# Altium project GateWay.PrjPCB
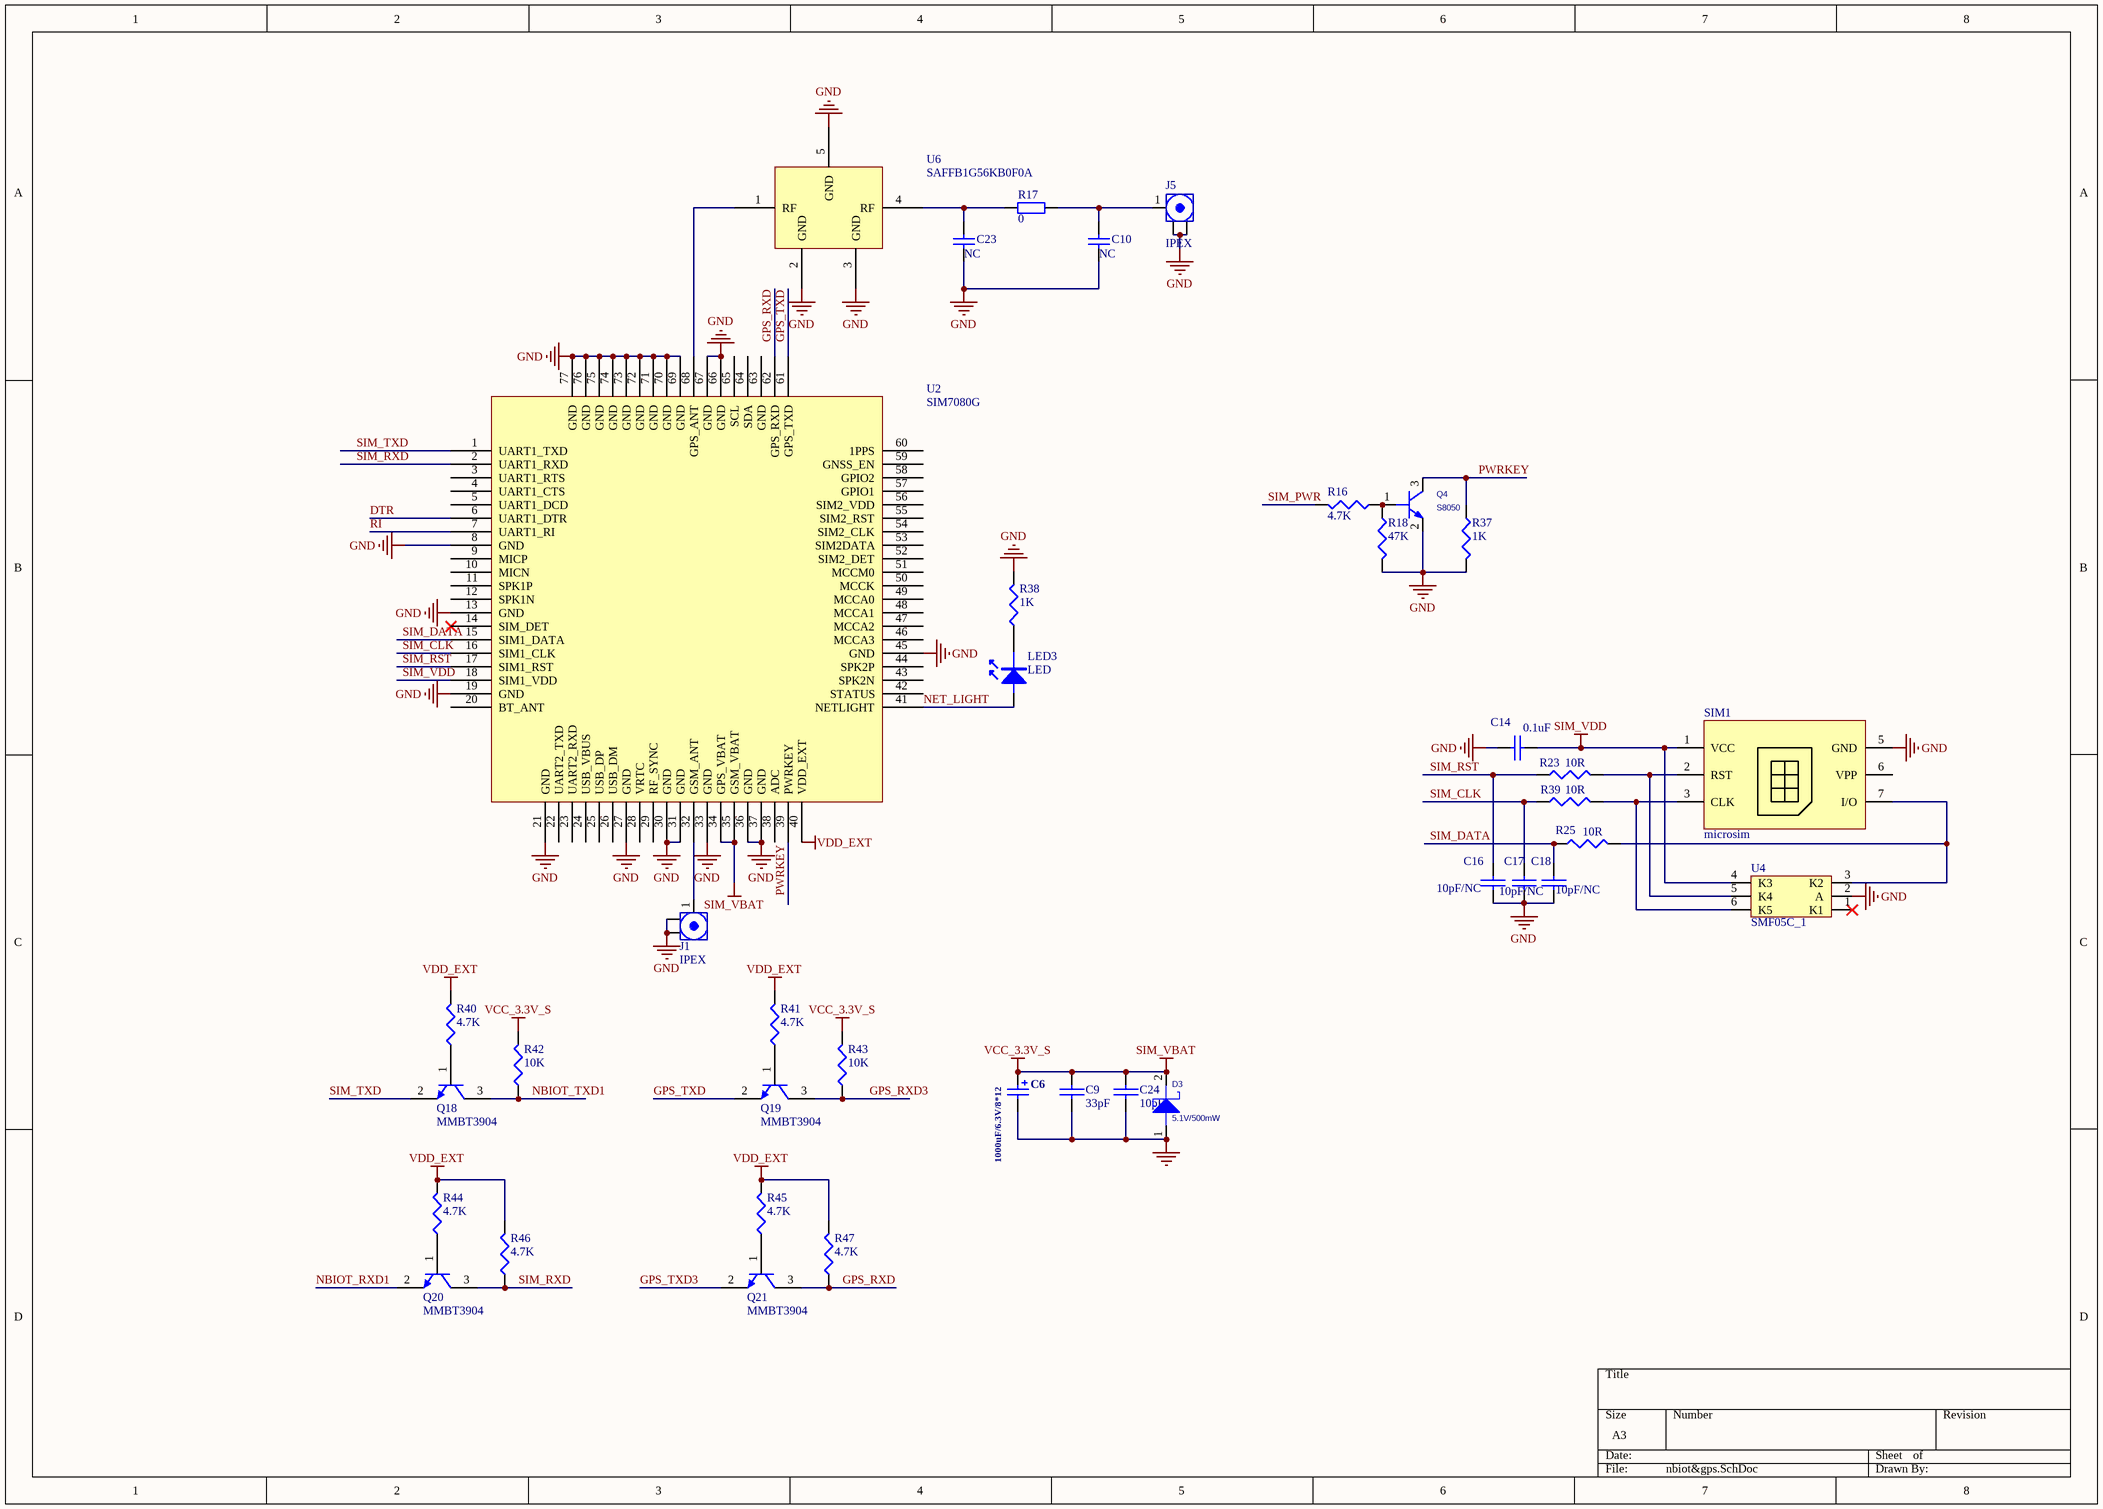
[diagram p0: nbiot&gps.SchDoc]
2 sheets, 85 parts. Net scope: global (net labels, ports and power ports of the same name join across sheets).
Board file: GateWay.PcbDoc
Sheets:
  nbiot&gps.SchDoc
  CONNECTOR.SchDoc

## Sheet nbiot&gps.SchDoc
size A3

### Parts
C6  1000uF/6.3V/8*12  [8*12]
C9  33pF  [0603C]
C10  NC  [0603C]
C14  0.1uF  [0603C]
C16  10pF/NC  [0603C]
C17  10pF/NC  [0603C]
C18  10pF/NC  [0603C]
C23  NC  [0603C]
C24  10pF  [0603C]
D3  value 5.1V/500mW  [LL-34(D1206)]  (hidden comment: DIODE_SCHOTTKY_0)
J1  IPEX  [RF-UFL]
J5  IPEX  [RF-UFL]
LED3  LED  [0603LED]
Q4  S8050  [SOT23]
Q18  MMBT3904  [SOT23-3]
Q19  MMBT3904  [SOT23-3]
Q20  MMBT3904  [SOT23-3]
Q21  MMBT3904  [SOT23-3]
R16  4.7K  [0603R]
R17  0  [0603R]
R18  47K  [0603R]
R23  10R  [0603R]
R25  10R  [0603R]
R37  1K  [0603R]
R38  1K  [0603R]
R39  10R  [0603R]
R40  4.7K  [0603R]
R41  4.7K  [0603R]
R42  10K  [0603R]
R43  10K  [0603R]
R44  4.7K  [0603R]
R45  4.7K  [0603R]
R46  4.7K  [0603R]
R47  4.7K  [0603R]
SIM1  microsim  [Nano SIM]
U2  SIM7080G  [SIM868]
U4  SMF05C_1  [SC70-6L]
U6  SAFFB1G56KB0F0A  [SAFFB1G56KB0F0A]

### Nets
GND: C6.2 C9.1 C10.2 C14.1 C16.1 C17.1 C18.1 C23.2 C24.1 D3.1 J1.2(Y) J5.2(Y) Q4.2(E) R18.2 R37.2 R38.2 SIM1.5(GND) U2.8(GND) U2.13(GND) U2.19(GND) U2.21(GND) U2.27(GND) U2.30(GND) U2.31(GND) U2.33(GND) U2.36(GND) U2.37(GND) U2.45(GND) U2.66(GND) U2.67(GND) U2.69(GND) U2.70(GND) U2.71(GND) U2.72(GND) U2.73(GND) U2.74(GND) U2.75(GND) U2.76(GND) U2.77(GND) U4.2(A) U6.2(GND) U6.3(GND) U6.5(GND)
SIM_VBAT: C6.1 C9.2 C24.2 D3.2 R42.2 R43.2 U2.34(GPS_VBAT) U2.35(GSM_VBAT)  [also labelled VCC_3.3V_S]
SIM_VDD: C14.2 SIM1.1(VCC) U2.18(SIM1_VDD) U4.4(K3)
VDD_EXT: R40.2 R41.2 R44.2 R45.2 R46.2 R47.2 U2.40(VDD_EXT)
DTR: U2.6(UART1_DTR)
GPS_RXD: Q21.3(C) R47.1 U2.62(GPS_RXD)
GPS_RXD3: Q19.3(C) R43.1
GPS_TXD: Q19.2(E) U2.61(GPS_TXD)
GPS_TXD3: Q21.2(E)
NBIOT_RXD1: Q20.2(E)
NBIOT_TXD1: Q18.3(C) R42.1
NET_LIGHT: LED3.1 U2.41(NETLIGHT)
PWRKEY: Q4.3(C) R37.1 U2.39(PWRKEY)
RI: U2.7(UART1_RI)
SIM_CLK: C17.2 R39.1 U2.16(SIM1_CLK)
SIM_DATA: C18.2 R25.1 U2.15(SIM1_DATA)
SIM_PWR: R16.2
SIM_RST: C16.2 R23.1 U2.17(SIM1_RST)
SIM_RXD: Q20.3(C) R46.1 U2.2(UART1_RXD)
SIM_TXD: Q18.2(E) U2.1(UART1_TXD)
NetC10_1: C10.1 J5.1(X) R17.2
NetC23_1: C23.1 R17.1 U6.4(RF)
NetJ1_1: J1.1(X) U2.32(GSM_ANT)
NetLED3_2: LED3.2 R38.1
NetQ4_1: Q4.1(B) R16.1 R18.1
NetQ18_1: Q18.1(B) R40.1
NetQ19_1: Q19.1(B) R41.1
NetQ20_1: Q20.1(B) R44.1
NetQ21_1: Q21.1(B) R45.1
NetR23_2: R23.2 SIM1.2(RST) U4.5(K4)
NetR25_2: R25.2 SIM1.7(I/O) U4.3(K2)
NetR39_2: R39.2 SIM1.3(CLK) U4.6(K5)
NetU2_68: U2.68(GPS_ANT) U6.1(RF)

Not connected (* = marked no-connect by the designer): SIM1 6(VPP); U2 3(UART1_RTS) 4(UART1_CTS) 5(UART1_DCD) 9(MICP) 10(MICN) 11(SPK1P) 12(SPK1N) 14(SIM_DET)* 20(BT_ANT) 22(UART2_TXD) 23(UART2_RXD) 24(USB_VBUS) 25(USB_DP) 26(USB_DM) 28(VRTC) 29(RF_SYNC) 38(ADC) 42(STATUS) 43(SPK2N) 44(SPK2P) 46(MCCA3) 47(MCCA2) 48(MCCA1) 49(MCCA0) 50(MCCK) 51(MCCM0) 52(SIM2_DET) 53(SIM2DATA) 54(SIM2_CLK) 55(SIM2_RST) 56(SIM2_VDD) 57(GPIO1) 58(GPIO2) 59(GNSS_EN) 60(1PPS) 63(GND) 64(SDA) 65(SCL); U4 1(K1)*

### Library data of the parts
C6 = Cap Pol3: Polarized Capacitor (Surface Mount); PackageReference: C10*10.2
C9 C14 C16-C18 C24 = CAP: Capacitor
C10 C23 = Cap: Capacitor; Value: 0.1uF/10V; Published: 8-Jun-2000; LatestRevisionDate: 17-Jul-2002; LatestRevisionNote: Re-released for DXP Platform.; PackageReference: RAD-0.3; Publisher: Altium Limited
D3 = DIODE_SCHOTTKY_0: PCB DECAL: DO_214AC; Source_Path: E:\AIH\WORK\A\LIBRARY1.OLB
J1 J5 = ANT
Q4 = 2N1069_1: PspiceTemplate: Q^@REFDES %C %B %E
Q18-Q21 = NPN
R16 R18 R23 R25 R37-R47 = RES1: P: 1/8W
R17 = Res2: Resistor; Published: 8-Jun-2000; LatestRevisionDate: 17-Jul-2002; LatestRevisionNote: Re-released for DXP Platform.; PackageReference: AXIAL-0.4; Publisher: Altium Limited; Value: 0
U2 = SIM868E/SIM868
U4 = SMF05C_1: TVS
U6 = SAFFB1G56KBOFA

## Sheet CONNECTOR.SchDoc
size A3
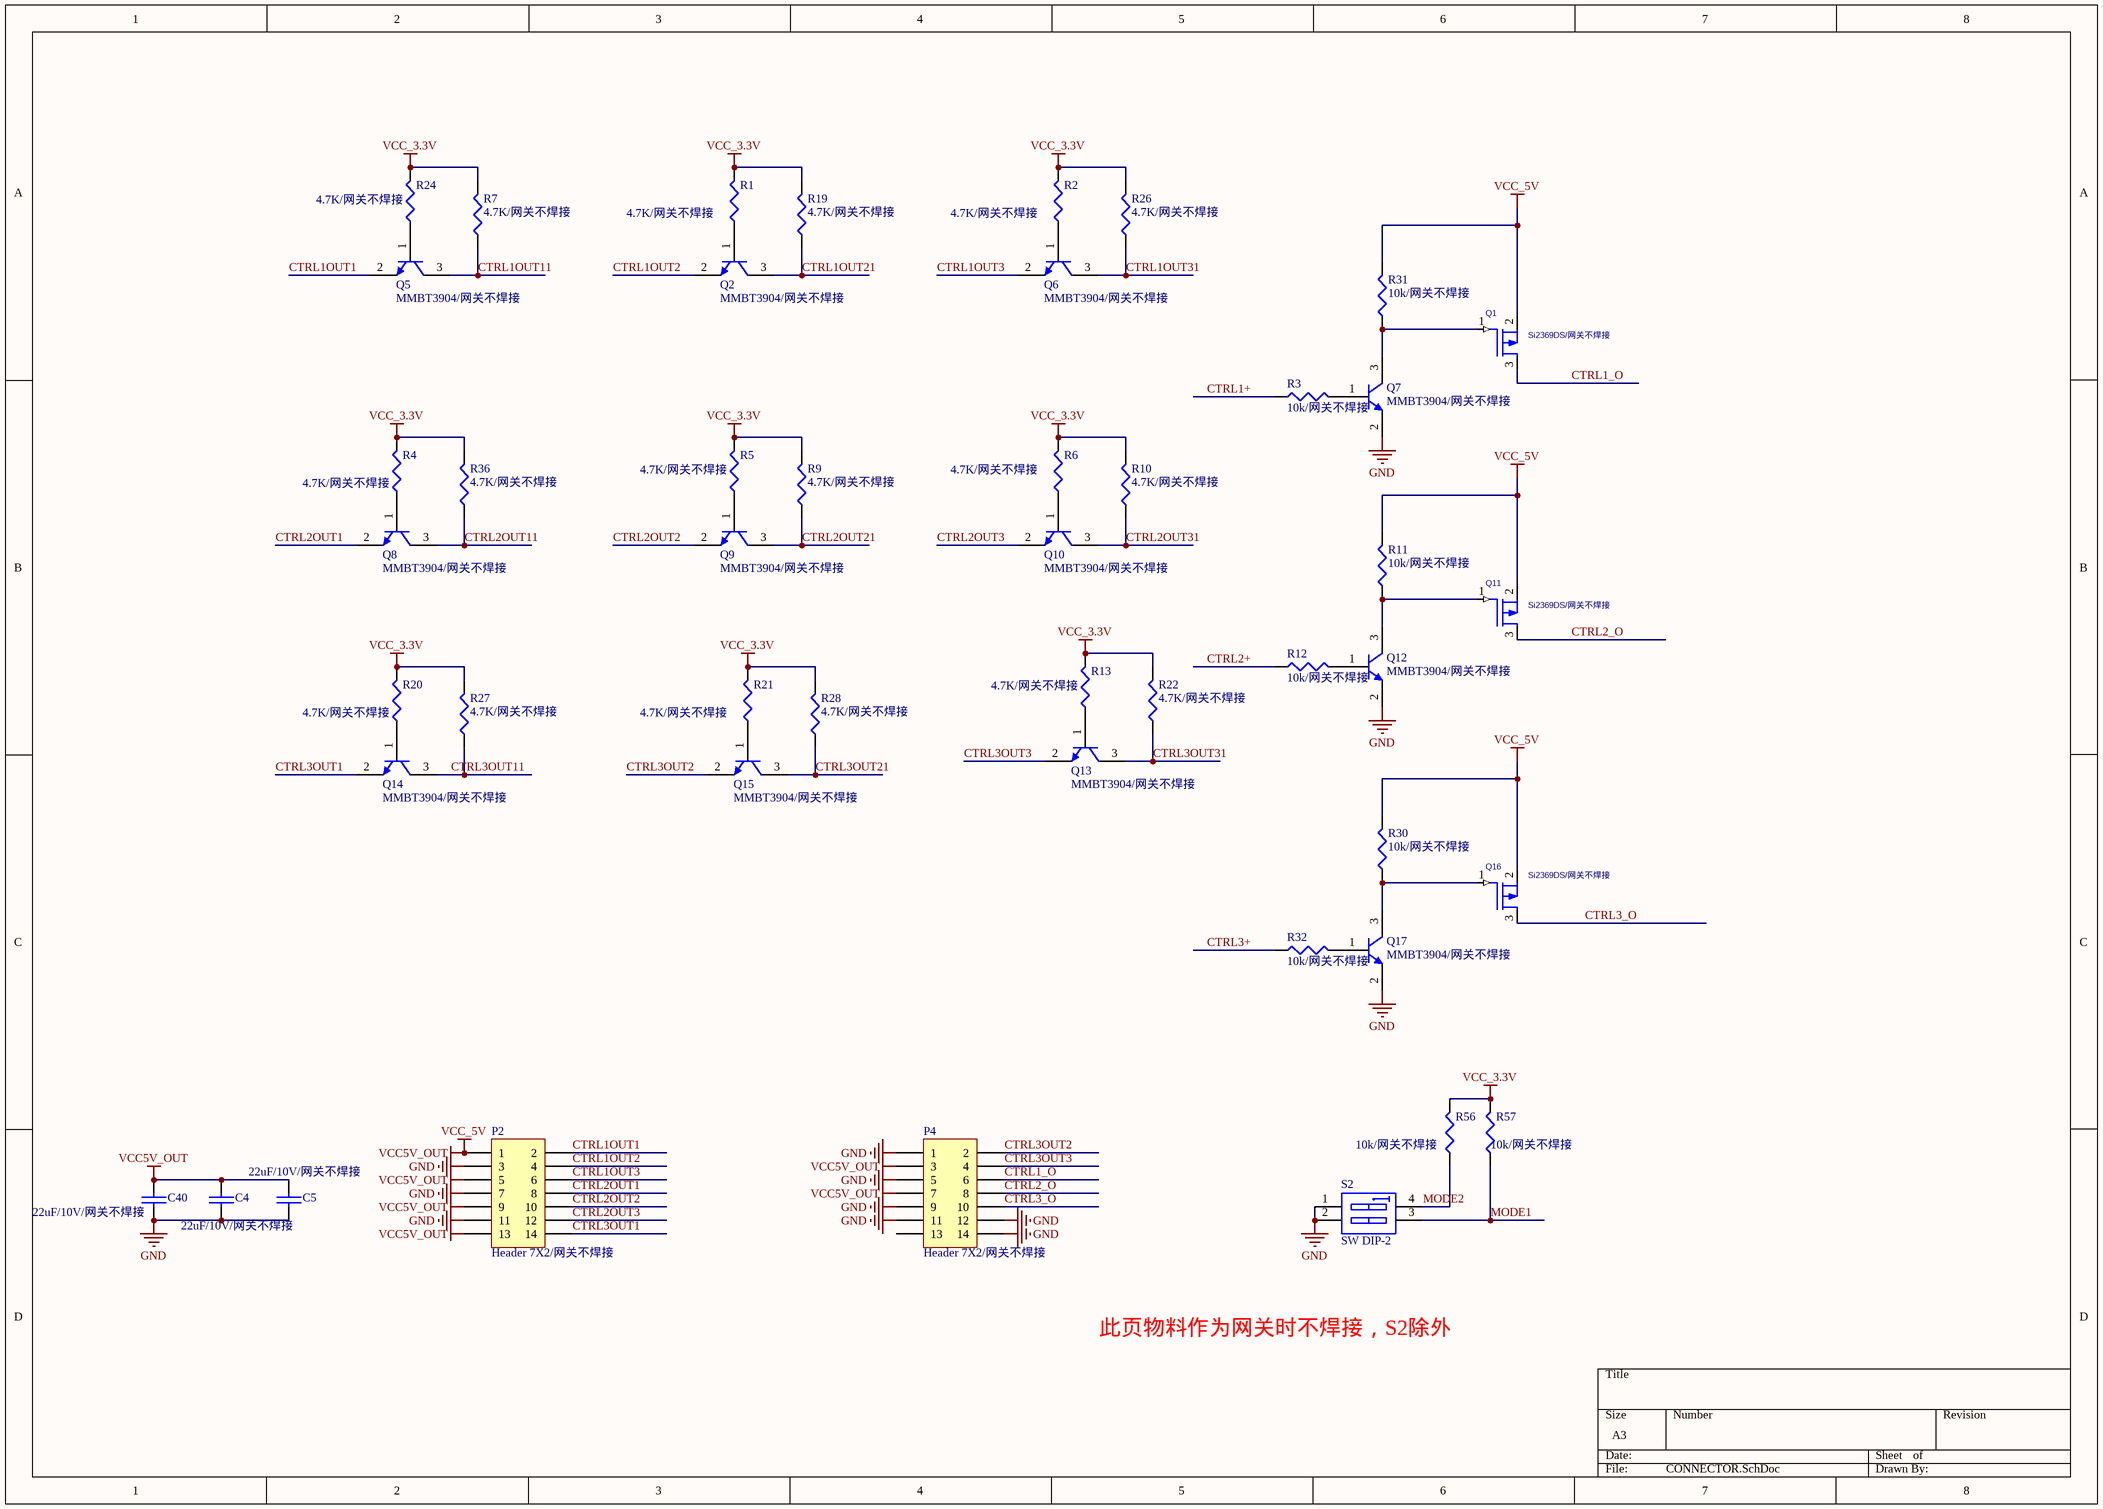
[diagram p1: CONNECTOR.SchDoc]

### Parts
C4  22uF/10V/网关不焊接  [1206C]
C5  22uF/10V/网关不焊接  [1206C]
C40  22uF/10V/网关不焊接  [1206C]
P2  Header 7X2/网关不焊接  [14X2.54MMZ]
P4  Header 7X2/网关不焊接  [14X2.54MMZ]
Q1  Si2369DS/网关不焊接  [SOT23]
Q2  MMBT3904/网关不焊接  [SOT23-3]
Q5  MMBT3904/网关不焊接  [SOT23-3]
Q6  MMBT3904/网关不焊接  [SOT23-3]
Q7  MMBT3904/网关不焊接  [SOT23-3]
Q8  MMBT3904/网关不焊接  [SOT23-3]
Q9  MMBT3904/网关不焊接  [SOT23-3]
Q10  MMBT3904/网关不焊接  [SOT23-3]
Q11  Si2369DS/网关不焊接  [SOT23]
Q12  MMBT3904/网关不焊接  [SOT23-3]
Q13  MMBT3904/网关不焊接  [SOT23-3]
Q14  MMBT3904/网关不焊接  [SOT23-3]
Q15  MMBT3904/网关不焊接  [SOT23-3]
Q16  Si2369DS/网关不焊接  [SOT23]
Q17  MMBT3904/网关不焊接  [SOT23-3]
R1  4.7K/网关不焊接  [0603R]
R2  4.7K/网关不焊接  [0603R]
R3  10k/网关不焊接  [0603R]
R4  4.7K/网关不焊接  [0603R]
R5  4.7K/网关不焊接  [0603R]
R6  4.7K/网关不焊接  [0603R]
R7  4.7K/网关不焊接  [0603R]
R9  4.7K/网关不焊接  [0603R]
R10  4.7K/网关不焊接  [0603R]
R11  10k/网关不焊接  [0603R]
R12  10k/网关不焊接  [0603R]
R13  4.7K/网关不焊接  [0603R]
R19  4.7K/网关不焊接  [0603R]
R20  4.7K/网关不焊接  [0603R]
R21  4.7K/网关不焊接  [0603R]
R22  4.7K/网关不焊接  [0603R]
R24  4.7K/网关不焊接  [0603R]
R26  4.7K/网关不焊接  [0603R]
R27  4.7K/网关不焊接  [0603R]
R28  4.7K/网关不焊接  [0603R]
R30  10k/网关不焊接  [0603R]
R31  10k/网关不焊接  [0603R]
R32  10k/网关不焊接  [0603R]
R36  4.7K/网关不焊接  [0603R]
R56  10k/网关不焊接  [0603R]
R57  10k/网关不焊接  [0603R]
S2  SW DIP-2  [SW_SMT_4]

### Nets
GND: C4.2 C5.2 C40.2 P2.3 P2.7 P2.11 P4.1 P4.5 P4.9 P4.11 P4.12 P4.14 Q7.2(E) Q12.2(E) Q17.2(E) S2.1(A1) S2.2(A2)
VCC5V_OUT: C4.1 C5.1 C40.1 P2.1 P2.5 P2.9 P2.13 P4.3 P4.7 Q1.2(DRAIN) Q11.2(DRAIN) Q16.2(DRAIN) R11.2 R30.2 R31.2  [also labelled VCC_5V]
VCC_3.3V: R1.2 R2.2 R4.2 R5.2 R6.2 R7.2 R9.2 R10.2 R13.2 R19.2 R20.2 R21.2 R22.2 R24.2 R26.2 R27.2 R28.2 R36.2 R56.2 R57.2
CTRL1+: R3.1
CTRL1_O: P4.6 Q1.3(SOURCE)
CTRL1OUT1: P2.2 Q5.2(E)
CTRL1OUT2: P2.4 Q2.2(E)
CTRL1OUT3: P2.6 Q6.2(E)
CTRL1OUT11: Q5.3(C) R7.1
CTRL1OUT21: Q2.3(C) R19.1
CTRL1OUT31: Q6.3(C) R26.1
CTRL2+: R12.1
CTRL2_O: P4.8 Q11.3(SOURCE)
CTRL2OUT1: P2.8 Q8.2(E)
CTRL2OUT2: P2.10 Q9.2(E)
CTRL2OUT3: P2.12 Q10.2(E)
CTRL2OUT11: Q8.3(C) R36.1
CTRL2OUT21: Q9.3(C) R9.1
CTRL2OUT31: Q10.3(C) R10.1
CTRL3+: R32.1
CTRL3_O: P4.10 Q16.3(SOURCE)
CTRL3OUT1: P2.14 Q14.2(E)
CTRL3OUT2: P4.2 Q15.2(E)
CTRL3OUT3: P4.4 Q13.2(E)
CTRL3OUT11: Q14.3(C) R27.1
CTRL3OUT21: Q15.3(C) R28.1
CTRL3OUT31: Q13.3(C) R22.1
MODE1: R57.1 S2.3(B2)
MODE2: R56.1 S2.4(B1)
NetQ1_1: Q1.1(GATE) Q7.3(C) R31.1
NetQ2_1: Q2.1(B) R1.1
NetQ5_1: Q5.1(B) R24.1
NetQ6_1: Q6.1(B) R2.1
NetQ7_1: Q7.1(B) R3.2
NetQ8_1: Q8.1(B) R4.1
NetQ9_1: Q9.1(B) R5.1
NetQ10_1: Q10.1(B) R6.1
NetQ11_1: Q11.1(GATE) Q12.3(C) R11.1
NetQ12_1: Q12.1(B) R12.2
NetQ13_1: Q13.1(B) R13.1
NetQ14_1: Q14.1(B) R20.1
NetQ15_1: Q15.1(B) R21.1
NetQ16_1: Q16.1(GATE) Q17.3(C) R30.1
NetQ17_1: Q17.1(B) R32.2

Not connected (* = marked no-connect by the designer): P4 13

### Notes on the sheet
- 此页物料作为网关时不焊接，S2除外

### Library data of the parts
C4 C5 C40 = CAP: Capacitor
P2 P4 = Header 7X2: Header, 7-Pin, Dual row; LatestRevisionDate: 17-Jul-2002; LatestRevisionNote: Re-released for DXP Platform.; Publisher: Altium Limited
Q1 Q11 Q16 = MOSFET P_1: Color: RGB(255,  0,  0)
Q2 Q5-Q10 Q12-Q15 Q17 = NPN
R1-R7 R9-R13 R19-R22 R24 R26-R28 R30-R32 R36 R56 R57 = RES1: P: 1/8W
S2 = SW DIP-2: DIP Switch, 2 Position, SPST; Published: 24-Mar-1999; LatestRevisionDate: 17-Jul-2002; LatestRevisionNote: Re-released for DXP Platform.; PackageReference: DIP-4; Publisher: Altium Limited

## Nets that join several sheets
GND: nbiot&gps (43 pins), CONNECTOR (17 pins)